# EAGLE design WSN_Atmega8a_V1.2 (EAGLE 9.6.2)
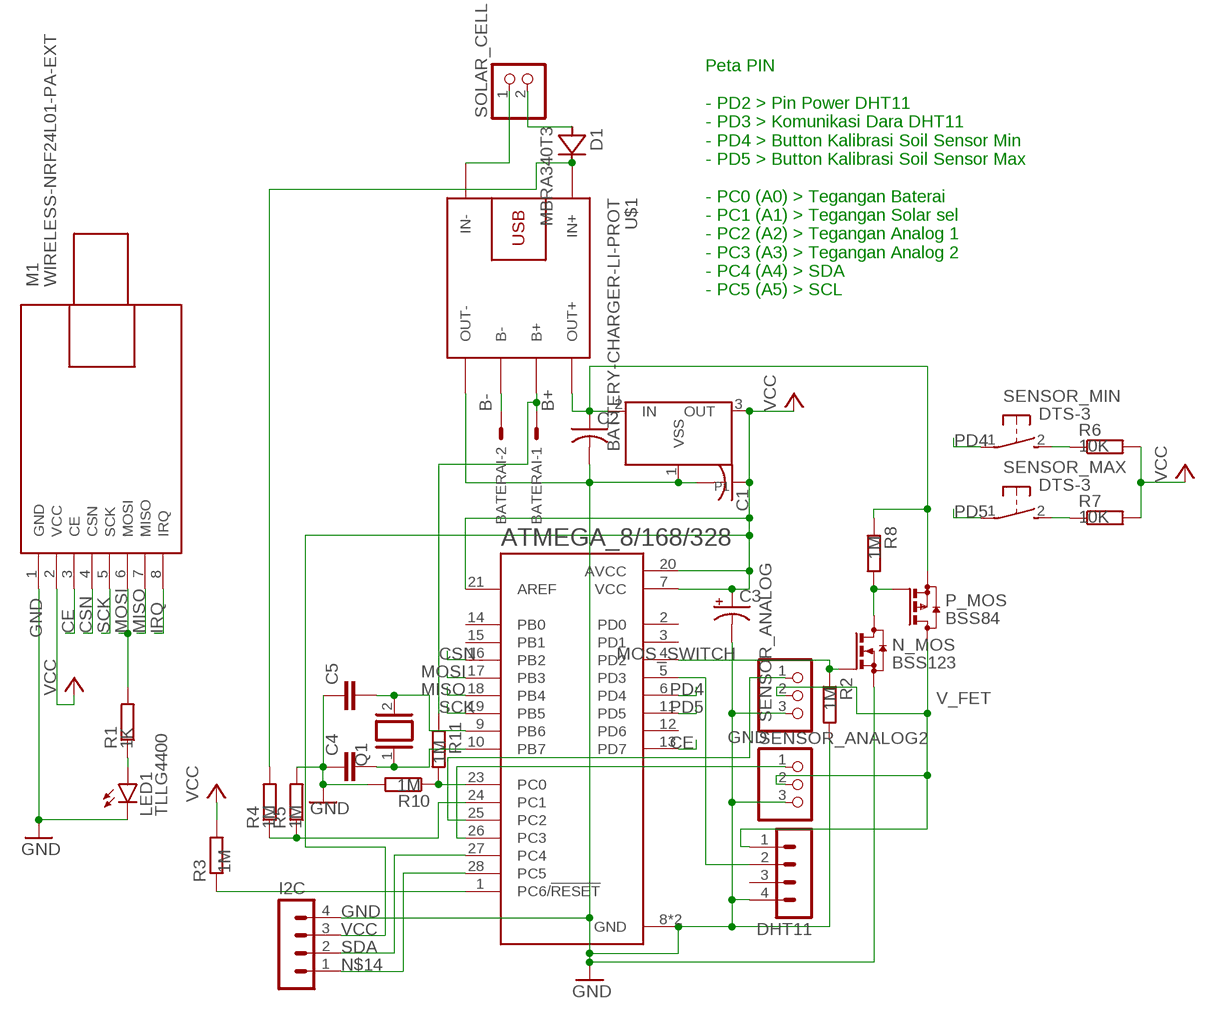
[diagram p0: schematic, sheet 1]

## Parts
ATMEGA_8/168/328  ATMEGA328P-PU  [DIP794W46P254L2967H457Q28B]
BATERAI  22-23-2021  [22-23-2021]
C1  C-USC0402  [C0402]
C2  C-USC0402  [C0402]
C3  CPOL-USE2.5-6  [E2,5-6]
C4  C-EU025-024X044  [C025-024X044]
C5  C-EU025-024X044  [C025-024X044]
D1  MBRA340T3  [SMA]
DHT11  MA04-1  [MA04-1]
I2C  MA04-1  [MA04-1]
LED1  TLLG4400  [LED3MM]
M1  WIRELESS-NRF24L01-PA-EXT  [WIRELESS-NRF24L01-PA-EXT]
N_MOS  BSS123  [SOT23]
P1  XC6206SOT-89  [SOT-89]
P_MOS  BSS84  [SOT23]
Q1  XTAL/S  [QS]
R1  1K  R-EU_R0805  [R0805]
R2  1M  R-EU_R0805  [R0805]
R3  1M  R-EU_R0805  [R0805]
R4  1M  R-EU_R0805  [R0805]
R5  1M  R-EU_R0805  [R0805]
R6  10K  R-EU_R0805  [R0805]
R7  10K  R-EU_R0805  [R0805]
R8  1M  R-EU_R0805  [R0805]
R10  1M  R-EU_R0805  [R0805]
R11  1M  R-EU_R0805  [R0805]
SENSOR_ANALOG  PINHD-1X3/90  [1X03/90]
SENSOR_ANALOG2  PINHD-1X3/90  [1X03/90]
SENSOR_MAX  DTS-3  [DTS-3]
SENSOR_MIN  DTS-3  [DTS-3]
SOLAR_CELL  PINHD-1X2  [1X02]
U$1  BATTERY-CHARGER-LI-PROT  [BATTERY-CHARGER-LI-PROT]

## Nets
B+: BATERAI.1 R11.1 U$1.B+
B-: BATERAI.2 U$1.B-
CE: ATMEGA_8/168/328.13(PD7) M1.3(CE)
CSN: ATMEGA_8/168/328.16(PB2) M1.4(CSN)
GND: ATMEGA_8/168/328.8(GND) ATMEGA_8/168/328.22(GND) C1.2 C2.2 C3.- C4.1 C5.1 DHT11.4 I2C.4 LED1.K(C) M1.1(GND) N_MOS.2(S) P1.1(VSS) R2.2 R5.2 R10.2 SENSOR_ANALOG2.3 SENSOR_ANALOG.3 U$1.OUT-
IRQ: M1.8(IRQ)
MISO: ATMEGA_8/168/328.18(PB4) M1.7(MISO)
MOS_SWITCH: ATMEGA_8/168/328.4(PD2) N_MOS.1(G) R2.1
MOSI: ATMEGA_8/168/328.17(PB3) M1.6(MOSI) R1.2
N$1: ATMEGA_8/168/328.1(PC6/!RESET) R3.1
N$2: C2.1 P1.2(IN) P_MOS.2(S) R8.1 U$1.OUT+
N$3: LED1.A R1.1
N$4: R6.1 SENSOR_MIN.2
N$5: ATMEGA_8/168/328.9(PB6) C5.2 Q1.2
N$6: ATMEGA_8/168/328.10(PB7) C4.2 Q1.1
N$7: R7.1 SENSOR_MAX.2
N$8: N_MOS.3(D) P_MOS.1(G) R8.2
N$9: ATMEGA_8/168/328.25(PC2) SENSOR_ANALOG.1
N$10: SOLAR_CELL.1 U$1.IN-
N$11: ATMEGA_8/168/328.26(PC3) SENSOR_ANALOG2.1
N$12: D1.A SOLAR_CELL.2
N$13: ATMEGA_8/168/328.23(PC0) R10.1 R11.2
N$14: ATMEGA_8/168/328.28(PC5) I2C.1
N$15: ATMEGA_8/168/328.5(PD3) DHT11.2
N$17: ATMEGA_8/168/328.24(PC1) R4.1 R5.1
N$18: D1.C R4.2 U$1.IN+
PD4: ATMEGA_8/168/328.6(PD4) SENSOR_MIN.1
PD5: ATMEGA_8/168/328.11(PD5) SENSOR_MAX.1
SCK: ATMEGA_8/168/328.19(PB5) M1.5(SCK)
SDA: ATMEGA_8/168/328.27(PC4) I2C.2
V_FET: DHT11.1 P_MOS.3(D) SENSOR_ANALOG2.2 SENSOR_ANALOG.2
VCC: ATMEGA_8/168/328.7(VCC) ATMEGA_8/168/328.20(AVCC) ATMEGA_8/168/328.21(AREF) C1.1 C3.+ I2C.3 M1.2(VCC) P1.3(OUT) R3.2 R6.2 R7.2
Unconnected: ATMEGA_8/168/328.2(PD0) ATMEGA_8/168/328.3(PD1) ATMEGA_8/168/328.12(PD6) ATMEGA_8/168/328.14(PB0) ATMEGA_8/168/328.15(PB1) DHT11.3

## Notes on the sheet
- Peta PIN
  
  - PD2 > Pin Power DHT11
  - PD3 > Komunikasi Dara DHT11
  - PD4 > Button Kalibrasi Soil Sensor Min
  - PD5 > Button Kalibrasi Soil Sensor Max
  
  - PC0 (A0) > Tegangan Baterai
  - PC1 (A1) > Tegangan Solar sel
  - PC2 (A2) > Tegangan Analog 1 
  - PC3 (A3) > Tegangan Analog 2
  - PC4 (A4) > SDA
  - PC5 (A5) > SCL

## Library data of the parts
ATMEGA_8/168/328 = ATMEGA328P-PU:ATMEGA328P-PU: ATmega Series 20 MHz 32 KB Flash 2 KB SRAM 8-Bit Microcontroller - DIP-28 Check prices <https://pricing.snapeda.com/parts/ATMEGA328P-PU/Microchip/view-part?ref=eda>; AVAILABILITY: In Stock; DESCRIPTION: AVR AVR® ATmega Microcontroller IC 8-Bit 20MHz 32KB (16K x 16) FLASH 28-PDIP; MF: Microchip; MP: ATMEGA328P-PU; PACKAGE: PDIP-28 Atmel; PRICE: None; PURCHASE-URL: https://pricing.snapeda.com/search/part/ATMEGA328P-PU/?ref=eda
BATERAI = con-molex:22-23-2021: .100" (2.54mm) Center Header - 2 Pin; MF: MOLEX; MPN: 22-23-2021; OC_FARNELL: 1462926; OC_NEWARK: 25C3832
C1 C2 = rcl:C-US: CAPACITOR, American symbol; SPICEPREFIX: C
C3 = rcl:CPOL-US: POLARIZED CAPACITOR, American symbol; SPICEPREFIX: C
C4 C5 = rcl:C-EU: CAPACITOR, European symbol; SPICEPREFIX: C
D1 = diode:MBRA340T3: Surface Mount Schottky Power Rectifier Source: http://www.onsemi.com/pub_link/Collateral/MBRA340T3-D.PDF
DHT11 I2C = con-lstb:MA04-1: PIN HEADER; OC_FARNELL: unknown; OC_NEWARK: unknown
LED1 = led:TLLG4400: Low Current (2mA) LED 3 mm Tinted Diffused Package color GREEN Source: Data sheet <http://www.farnell.com/datasheets/391098.pdf>; MF: VISHAY SEMICONDUCTOR; OC_FARNELL: 1612435
M1 = diy-modules:WIRELESS-NRF24L01-PA-EXT: 2.4 GHz Wireless Module based on NRF24L01 chip with preamplifier and external antenna Click here to find device on ebay.com <http://www.ebay.com/sch/nrf24l01+pa+lna+sma>
N_MOS = transistor-small-signal:BSS123: N-CHANNEL MOS FET
P1 = voltage_regulator:XC6206: XC6206P , linear regulator. Producted by TOREX.Co Store Information: EXCEL device corporation http://www.excel-d.com/access/index.html
P_MOS = transistor-small-signal:BSS84: P-CHANNEL MOS FET
Q1 = special:XTAL/S: CRYSTAL
R1-R8 R10 R11 = rcl:R-EU_: RESISTOR, European symbol; SPICEPREFIX: R
SENSOR_ANALOG SENSOR_ANALOG2 = pinhead:PINHD-1X3: PIN HEADER
SENSOR_MAX SENSOR_MIN = switch-tact:DTS-3
SOLAR_CELL = pinhead:PINHD-1X2: PIN HEADER
U$1 = diy-modules:BATTERY-CHARGER-LI-PROT: Lithium Battery 5V Charger with protection circuit More details available here: http://www.instructables.com/id/DIY-Lithium-ion-Battery-Charger/step4/TP4056-based-lithium-ion-battery-charger-module/ Click here to find device on ebay.com <http://www.ebay.com/sch/tp4056+charger+usb+protection>

## Board
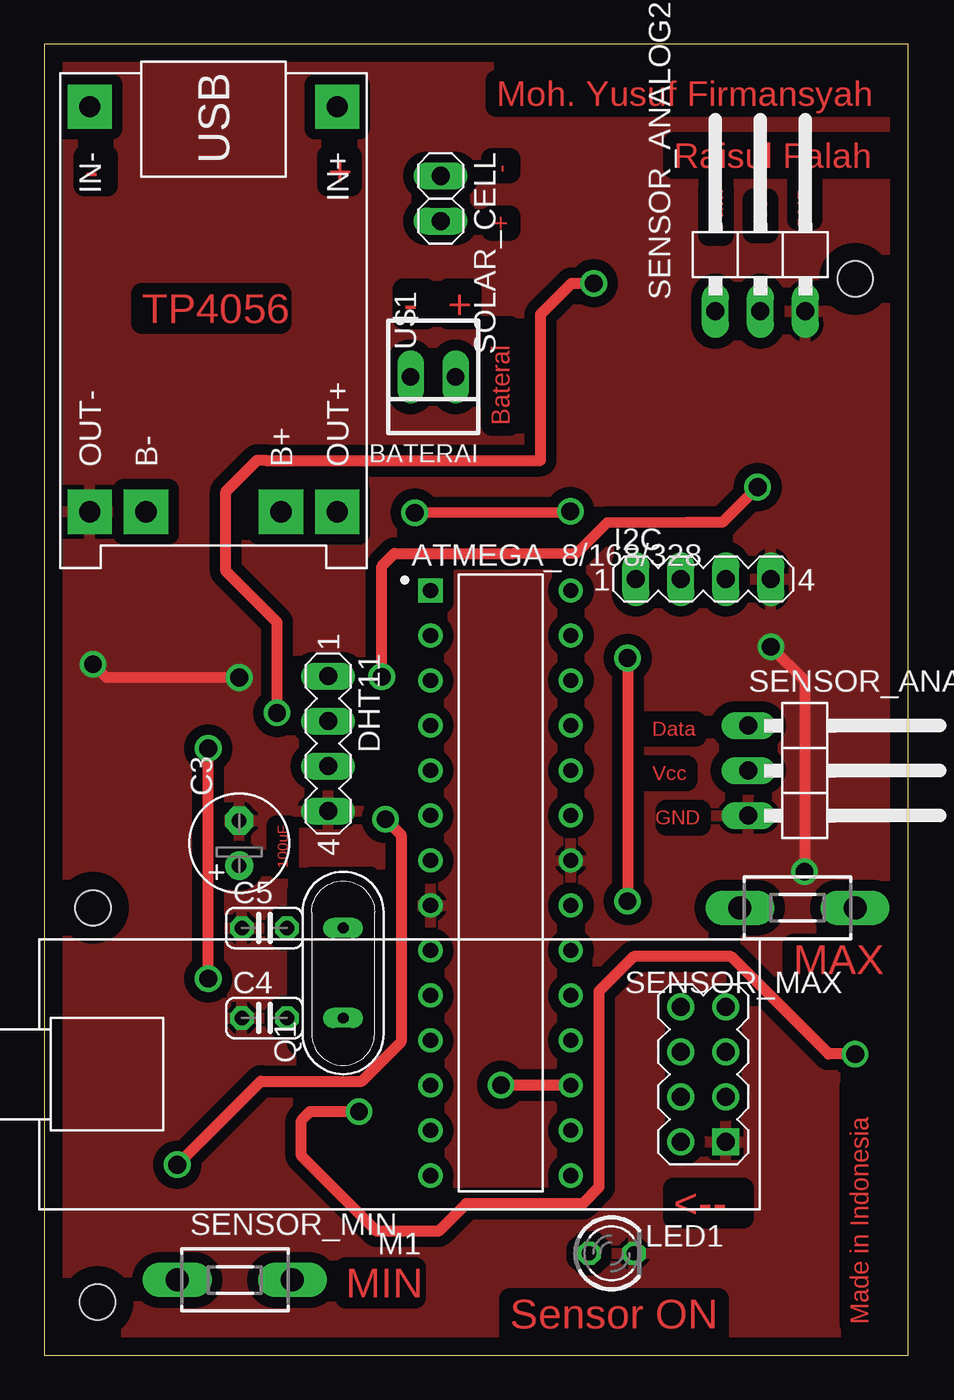
[diagram p1: board, top side]
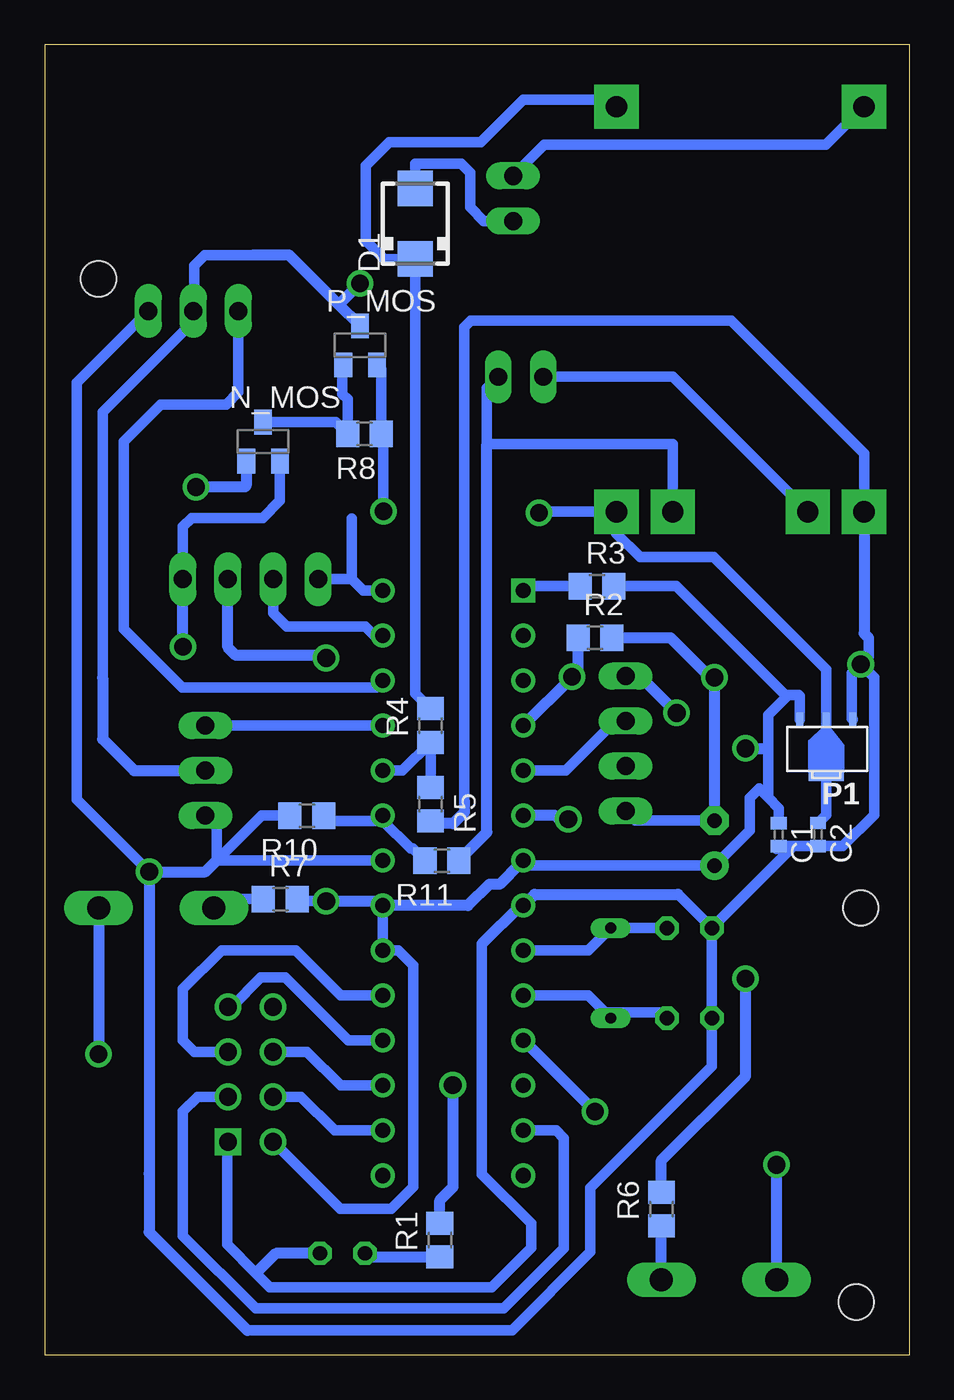
[diagram p2: board, bottom side, seen from below]

Size 48.75 x 73.99 mm. Coordinates in mm from the lower left corner, seen from the top.
Outline: 0,0 48.75,0 48.75,73.99 0,73.99 0,0
Copper layers (1*16): Top 0.035mm / dielectric 1.5mm / Bottom 0.035mm
Design rules "default *": minimum track width 0.6mm, minimum drill 0.35mm, track to track 0.6mm, track to pad 0.6mm, pad to pad 6mil, via to via 6mil, smd to smd 6mil, copper to edge 40mil, drill to drill 6mil, minimum pad ring 10mil, minimum via ring 8mil, stop-mask expansion 4mil, vias tented up to drill 0mil, thermal gap 10mil
Holes 2 mm at 3,3 45.75,60.75 2.75,25.25

### Footprints (pad centres in the part's own frame; a part is rotated, then mirrored left to right if it is on the bottom)
DIP794W46P254L2967H457Q28B = drill 0.85 square: 1 -3.96,16.51 | drill 0.85: 2 -3.96,13.97; 3 -3.96,11.43; 4 -3.96,8.89; 5 -3.96,6.35; 6 -3.96,3.81; 7 -3.96,1.27; 8 -3.96,-1.27; 9 -3.96,-3.81; 10 -3.96,-6.35; 11 -3.96,-8.89; 12 -3.96,-11.43; 13 -3.96,-13.97; 14 -3.96,-16.51; 15 3.96,-16.51; 16 3.96,-13.97; 17 3.96,-11.43; 18 3.96,-8.89; 19 3.96,-6.35; 20 3.96,-3.81; 21 3.96,-1.27; 22 3.96,1.27; 23 3.96,3.81; 24 3.96,6.35; 25 3.96,8.89; 26 3.96,11.43; 27 3.96,13.97; 28 3.96,16.51
22-23-2021 = drill 1 long: 1 -1.27,0; 2 1.27,0
C0402 = smd 0.7 x 0.9: 1 -0.65,0; 2 0.65,0
E2,5-6 = drill 0.813 pad 1.6: + -1.27,0 | drill 0.813 pad 1.6 octagon: - 1.27,0
C025-024X044 = drill 0.813 octagon: 1 -1.27,0; 2 1.27,0
SMA = smd 2 x 2: A 2,0; C -2,0
MA04-1 = drill 1.016 long: 1 -3.81,0; 2 -1.27,0; 3 1.27,0; 4 3.81,0
LED3MM = drill 0.813 octagon: A -1.27,0; K 1.27,0
WIRELESS-NRF24L01-PA-EXT = drill 1 square: 1 -18.415,3.81 | drill 1: 2 -15.875,3.81; 3 -18.415,1.27; 4 -15.875,1.27; 5 -18.415,-1.27; 6 -15.875,-1.27; 7 -18.415,-3.81; 8 -15.875,-3.81
SOT23 = smd 1 x 1.4: 1 -0.95,-1.1; 2 0.95,-1.1; 3 0,1.1
SOT-89 = smd 0.406 x 0.813: 1 -1.5,-1.6; 2 0,-1.6; 3 1.5,-1.6 | smd 2 x 0.5: P$4 0,1.6
QS = drill 0.61 long: 1 -2.54,0; 2 2.54,0
R0805 = smd 1.3 x 1.5: 1 -0.95,0; 2 0.95,0
1X03/90 = drill 1.016 long: 1 -2.54,-3.81; 2 0,-3.81; 3 2.54,-3.81
DTS-3 = drill 1.3 long: 1 -3.25,0; 2 3.25,0
1X02 = drill 1.016 long: 1 -1.27,0; 2 1.27,0
BATTERY-CHARGER-LI-PROT = drill 1.2 pad 2.5 square: B+ 10.795,3.81; B- 10.795,-3.81; IN+ -12.065,6.985; IN- -12.065,-6.985; OUT+ 10.795,6.985; OUT- 10.795,-6.985

### Placement (x,y rotation side)
ATMEGA_8/168/328  25.75,26.65 0 top
BATERAI  21.93,55.23 180 top
C1  7.37,29.37 270 bottom
C2  5.16,29.39 270 bottom
C3  10.99,28.9 90 top
C4  12.41,19.03 0 top
C5  12.41,24.11 0 top
D1  27.89,63.87 90 bottom
DHT11  16.01,34.52 270 top
I2C  37.18,43.8 0 top
LED1  32,5.75 0 top
M1  20.04,15.86 180 top
N_MOS  36.47,51.56 0 bottom
P1  4.7,34.27 180 bottom
P_MOS  31,57 0 bottom
Q1  16.86,21.57 90 top
R1  26.5,6.5 90 bottom
R2  17.75,40.5 0 bottom
R3  17.63,43.41 0 bottom
R4  27.02,35.54 90 bottom
R5  27.02,31.09 270 bottom
R6  14,8.25 90 bottom
R7  35.5,25.75 0 bottom
R8  30.75,52 180 bottom
R10  34.01,30.46 180 bottom
R11  26.39,27.92 180 bottom
SENSOR_ANALOG  43.53,33 270 top
SENSOR_ANALOG2  40.4,62.74 0 top
SENSOR_MAX  42.5,25.25 180 top
SENSOR_MIN  10.75,4.25 0 top
SOLAR_CELL  22.36,65.29 270 top
U$1  9.54,58.4 270 top

### Tracks (layer width: path | path; a pad name or v marks a point on that pad's centre or on a via)
B+
  Bottom 0.6: BATERAI.1 23.84,54.59 23.84,51.41 13.36,51.41 U$1.B+
  Bottom 0.61: R11.1 23.84,29.51 23.84,51.41
B-
  Bottom 0.6: U$1.B- 13.36,55.23 BATERAI.2
CE
  Bottom 0.6: M1.3 40.16,14.59 41,13.75 41,6.75 36.89,2.64 22.89,2.64 19.5,6.02 19.5,12.25 19.93,12.68 ATMEGA_8/168/328.13
CSN
  Bottom 0.6: M1.4 34.34,14.59 32.43,12.68 ATMEGA_8/168/328.16
GND  (via drill 1)
  Top 0.6: v11,38.25 3.5,38.25 v2.75,39
  Top 0.61: v40.99,39.98 42.9,38.08 v42.9,27.29
  Bottom 0.6: R10.2 36.55,30.46 39.09,27.92 | R5.2 26.67,30.5 | U$1.OUT- 2.56,50.9 10.06,58.4 24.75,58.4 25.11,58.03 25.11,31.28 | C5.1 C4.1 11.14,16.3 18,9.45 18,5.83 22.42,1.41 37.36,1.41 | 39.09,29.82 39.09,27.92 | C5.1 13.05,26.02 | 42.9,10.32 42.9,10.25 | M1.1 38.5,11.99 38.5,6.25 36.88,4.62 36.09,3.84 23.58,3.84 21.35,6.07 21.35,7.43 24.12,10.2 24.12,23.2 | v42.9,27.29 46.98,31.37 46.98,54.9 SENSOR_ANALOG2.3 | C2.2 5.12,28.74 | 7.5,28.59 C1.2 7.34,28.74 6.75,28.74 | P1.1 3.25,35.92 3.25,38.5 v2.75,39 | C2.2 6.75,28.74 | C5.1 6.75,28.5 6.75,28.74 | C2.2 3.76,28.74 2,30.5 2,38.25 v2.75,39 | v10.99,38.24 v11,38.25 | 2.31,40.48 2.31,39.44 v2.75,39 | DHT11.4 15.47,30.17 C3.- | N_MOS.2 35.52,48.23 36.5,47.25 40.5,47.25 40.99,46.76 I2C.4 | ATMEGA_8/168/328.22 39.09,27.92
  Bottom 0.61: U$1.OUT- 2.56,40.73 2.31,40.48 | 39.09,27.92 39.72,27.29 v42.9,27.29 42.9,10.25 42.9,6.94 37.36,1.41 | LED1.K 35.75,5.75 36.88,4.62 | v40.99,39.98 I2C.4 | SENSOR_ANALOG.3 39.09,29.82 | C3.- 10.99,38 | 10.99,38 v10.99,38.24 | 25.11,31.28 25.11,30.64 25.75,30 26.88,30 R5.2 | 13.05,26.02 21.16,26.02 ATMEGA_8/168/328.8 21.94,25.38 24.12,23.2 | R2.2 13.49,40.5 10.99,38
  pour Top: 0,74.75 0,-0.25 49,-0.25 49.25,0 49.5,0.25 49.5,74.5 49.25,74.75
MISO
  Bottom 0.6: ATMEGA_8/168/328.18 31.67,17.76 35.23,21.32 36.59,21.32 38.25,19.66 M1.7
MOS_SWITCH  (via drill 1)
  Top 0.6: 36.25,47 31.75,47 30,45.25 26.5,45.25
  Top 0.61: v19.04,38.29 19.04,44.54 19.75,45.25 26.5,45.25 | v40.25,49 38.25,47 36.25,47
  Bottom 0.61: ATMEGA_8/168/328.4 v19.04,38.29 18.7,38.63 R2.1 | N_MOS.1 37.42,49.08 37.5,49 v40.25,49
MOSI  (via drill 1)
  Top 0.61: v25.77,15.25 29.68,15.25 ATMEGA_8/168/328.17
  Bottom 0.6: M1.6 34.01,17.12 32.1,15.22 ATMEGA_8/168/328.17
  Bottom 0.61: R1.2 26.5,8.75 25.75,9.5 25.75,15.23 v25.77,15.25
N$1
  Bottom 0.6: ATMEGA_8/168/328.1 21.54,43.41 R3.1
N$2  (via drill 1)
  Top 0.6: v20.9,47.55 29.59,47.55 v29.68,47.64
  Bottom 0.6: v20.9,47.55 20.84,47.6 U$1.OUT+ 16.53,46.38 15.2,45.05 11.05,45.05 4.7,38.7 P1.2 4.7,30.5 C2.1 | v29.68,47.64 29.68,51.88 R8.1 29.8,55.65 P_MOS.2
  Bottom 0.61: 29.31,47.64 v29.68,47.64
N$3
  Bottom 0.61: LED1.A 30.53,5.55 R1.1
N$4
  Bottom 0.61: SENSOR_MIN.2 R6.1
N$5
  Bottom 0.6: ATMEGA_8/168/328.9 18.13,22.84 Q1.2 C5.2
N$6
  Bottom 0.6: Q1.1 17.18,19.35 | 17.18,19.35 18.13,20.3 ATMEGA_8/168/328.10 | C4.2 14,19.35 17.18,19.35
N$7
  Bottom 0.6: R7.1 38.75,25.75 SENSOR_MAX.2
N$8
  Bottom 0.6: P_MOS.1 32,55.85 32,54.25 31.7,53.95 R8.2 32.37,52.66 N_MOS.3
N$9
  Bottom 0.6: ATMEGA_8/168/328.25 SENSOR_ANALOG.1
N$10
  Bottom 0.6: SOLAR_CELL.1 20.61,68.31 4.71,68.31 U$1.IN-
N$11
  Bottom 0.6: SENSOR_ANALOG2.1 37.86,54.36 38.56,53.66 42.23,53.66 44.33,51.57 44.33,40.99 41.04,37.7 30.09,37.7 ATMEGA_8/168/328.26
N$12
  Bottom 0.6: 22.77,64.02 SOLAR_CELL.2 24.02,64.02 24.78,64.78 24.78,66.75 25.28,67.25 27.89,67.25 D1.A
N$13
  Bottom 0.6: R11.2 28.02,28.59 28.14,28.59 29.71,30.16 | 29.71,30.16 ATMEGA_8/168/328.23 | R10.1 32.76,30.16 29.71,30.16
N$14
  Bottom 0.6: ATMEGA_8/168/328.28 30.83,43.16 31.46,43.8 | 31.46,43.8 I2C.1 | 31.46,47.22 31.46,43.8
N$15
  Bottom 0.6: DHT11.2 16.61,35.79 19.4,33 ATMEGA_8/168/328.5
N$17
  Bottom 0.6: R5.1 R4.1 28.61,33 ATMEGA_8/168/328.24
N$18
  Bottom 0.6: R4.2 27.89,37.35 D1.C 29.64,61.87 30.68,62.91 30.68,67.12 29.35,68.45 24.2,68.45 21.8,70.85 16.14,70.85 U$1.IN+
PD4  (via drill 1)
  Top 0.61: v7.5,10.75 12.21,15.46 17.92,15.46 20.13,17.67 20.13,29.37 v19.25,30.25
  Bottom 0.61: SENSOR_MIN.1 v7.5,10.75 | v19.25,30.25 19.75,30.25 19.96,30.46 ATMEGA_8/168/328.6
PD5  (via drill 1)
  Top 0.61: v45.75,17 44.25,17 38.75,22.5 33.25,22.5 31.29,20.54 31.29,9.48 30.37,8.56 23.81,8.56 22.25,7 18.75,7 14.5,11.25 14.5,13.25 15,13.75 v17.75,13.75
  Bottom 0.61: SENSOR_MAX.1 v45.75,17 | v17.75,13.75 21.76,17.76 ATMEGA_8/168/328.11
  cutout Top: 15,27.25 14,26.25 14,17.5 15.75,15.75 18,15.75 19.5,17.25 19.5,26.25 18.5,27.25
SCK
  Bottom 0.6: M1.5 40.35,17.12 40.99,17.76 40.99,20.66 38.81,22.84 34.64,22.84 32.1,20.3 ATMEGA_8/168/328.19
SDA
  Bottom 0.6: ATMEGA_8/168/328.27 30.21,40.62 30.71,41.12 35.14,41.12 35.91,41.89 I2C.2
V_FET  (via drill 1)
  Top 0.61: v31,60.5 29.75,60.5 28,58.75 28,50.5 12.5,50.5 12,50.5 10.25,48.75 10.25,44.25 13.14,41.36 v13.14,36.25
  Bottom 0.6: SENSOR_ANALOG2.2 40.35,58.98 | 40.35,58.98 40.35,61.5 39.75,62.1 37,62.1 36.6,62.1 | 45.53,38.23 45.53,53.22 40.35,58.4 40.35,58.98
  Bottom 0.61: P_MOS.3 32.2,59.3 | 32.2,59.3 35,62.1 37,62.1 | 45.53,38.23 45.53,34.78 43.75,33 SENSOR_ANALOG.2 | v31,60.5 32.2,59.3 | DHT11.1 15.22,38.33 v13.14,36.25
VCC  (via drill 1)
  Top 0.61: v32.91,39.35 v32.91,25.63 | v9.25,21.25 v9.25,34.25
  Bottom 0.6: ATMEGA_8/168/328.21 ATMEGA_8/168/328.20 28.84,22.84 28,22 28,9.5 29.25,8.25 32.12,8.25 M1.2 | 7.97,31.48 7.97,34.25 7.97,36.12 6.92,37.17 | 21.88,27.63 21.98,27.73 | 6.92,37.17 13.16,43.41 R3.2 | C1.1 7.37,30.86 7.97,31.48 | 7.97,31.48 8.47,31.98 9,31.45 9,29.62 C3.+ 21.5,27.63 ATMEGA_8/168/328.7 | 6.92,37.17 6.85,37.25 6.25,37.25 6.2,37.2 P1.3 | v32.91,25.63 34.43,25.63 R7.2
  Bottom 0.61: v32.91,25.63 29.96,25.63 ATMEGA_8/168/328.21 24.91,25.38 23.71,26.59 23.12,26.59 21.98,27.73 ATMEGA_8/168/328.7 | R6.2 14,11 9.25,15.75 v9.25,21.25 | v9.25,34.25 7.97,34.25 | v32.91,39.35 33.06,39.5 38,39.5 38.45,39.95 I2C.3

### Text on the board
Top: Moh. Yusuf Firmansyah | - | Raisul Falah | - | + | Data | GND | Vcc | + | TP4056 | - | + | Baterai | Data | Vcc | GND | 100uF | MAX | <-- | MIN | Sensor ON | Made in Indonesia